# EAGLE schematic metal_mill_wiring (EAGLE 9.6.2)
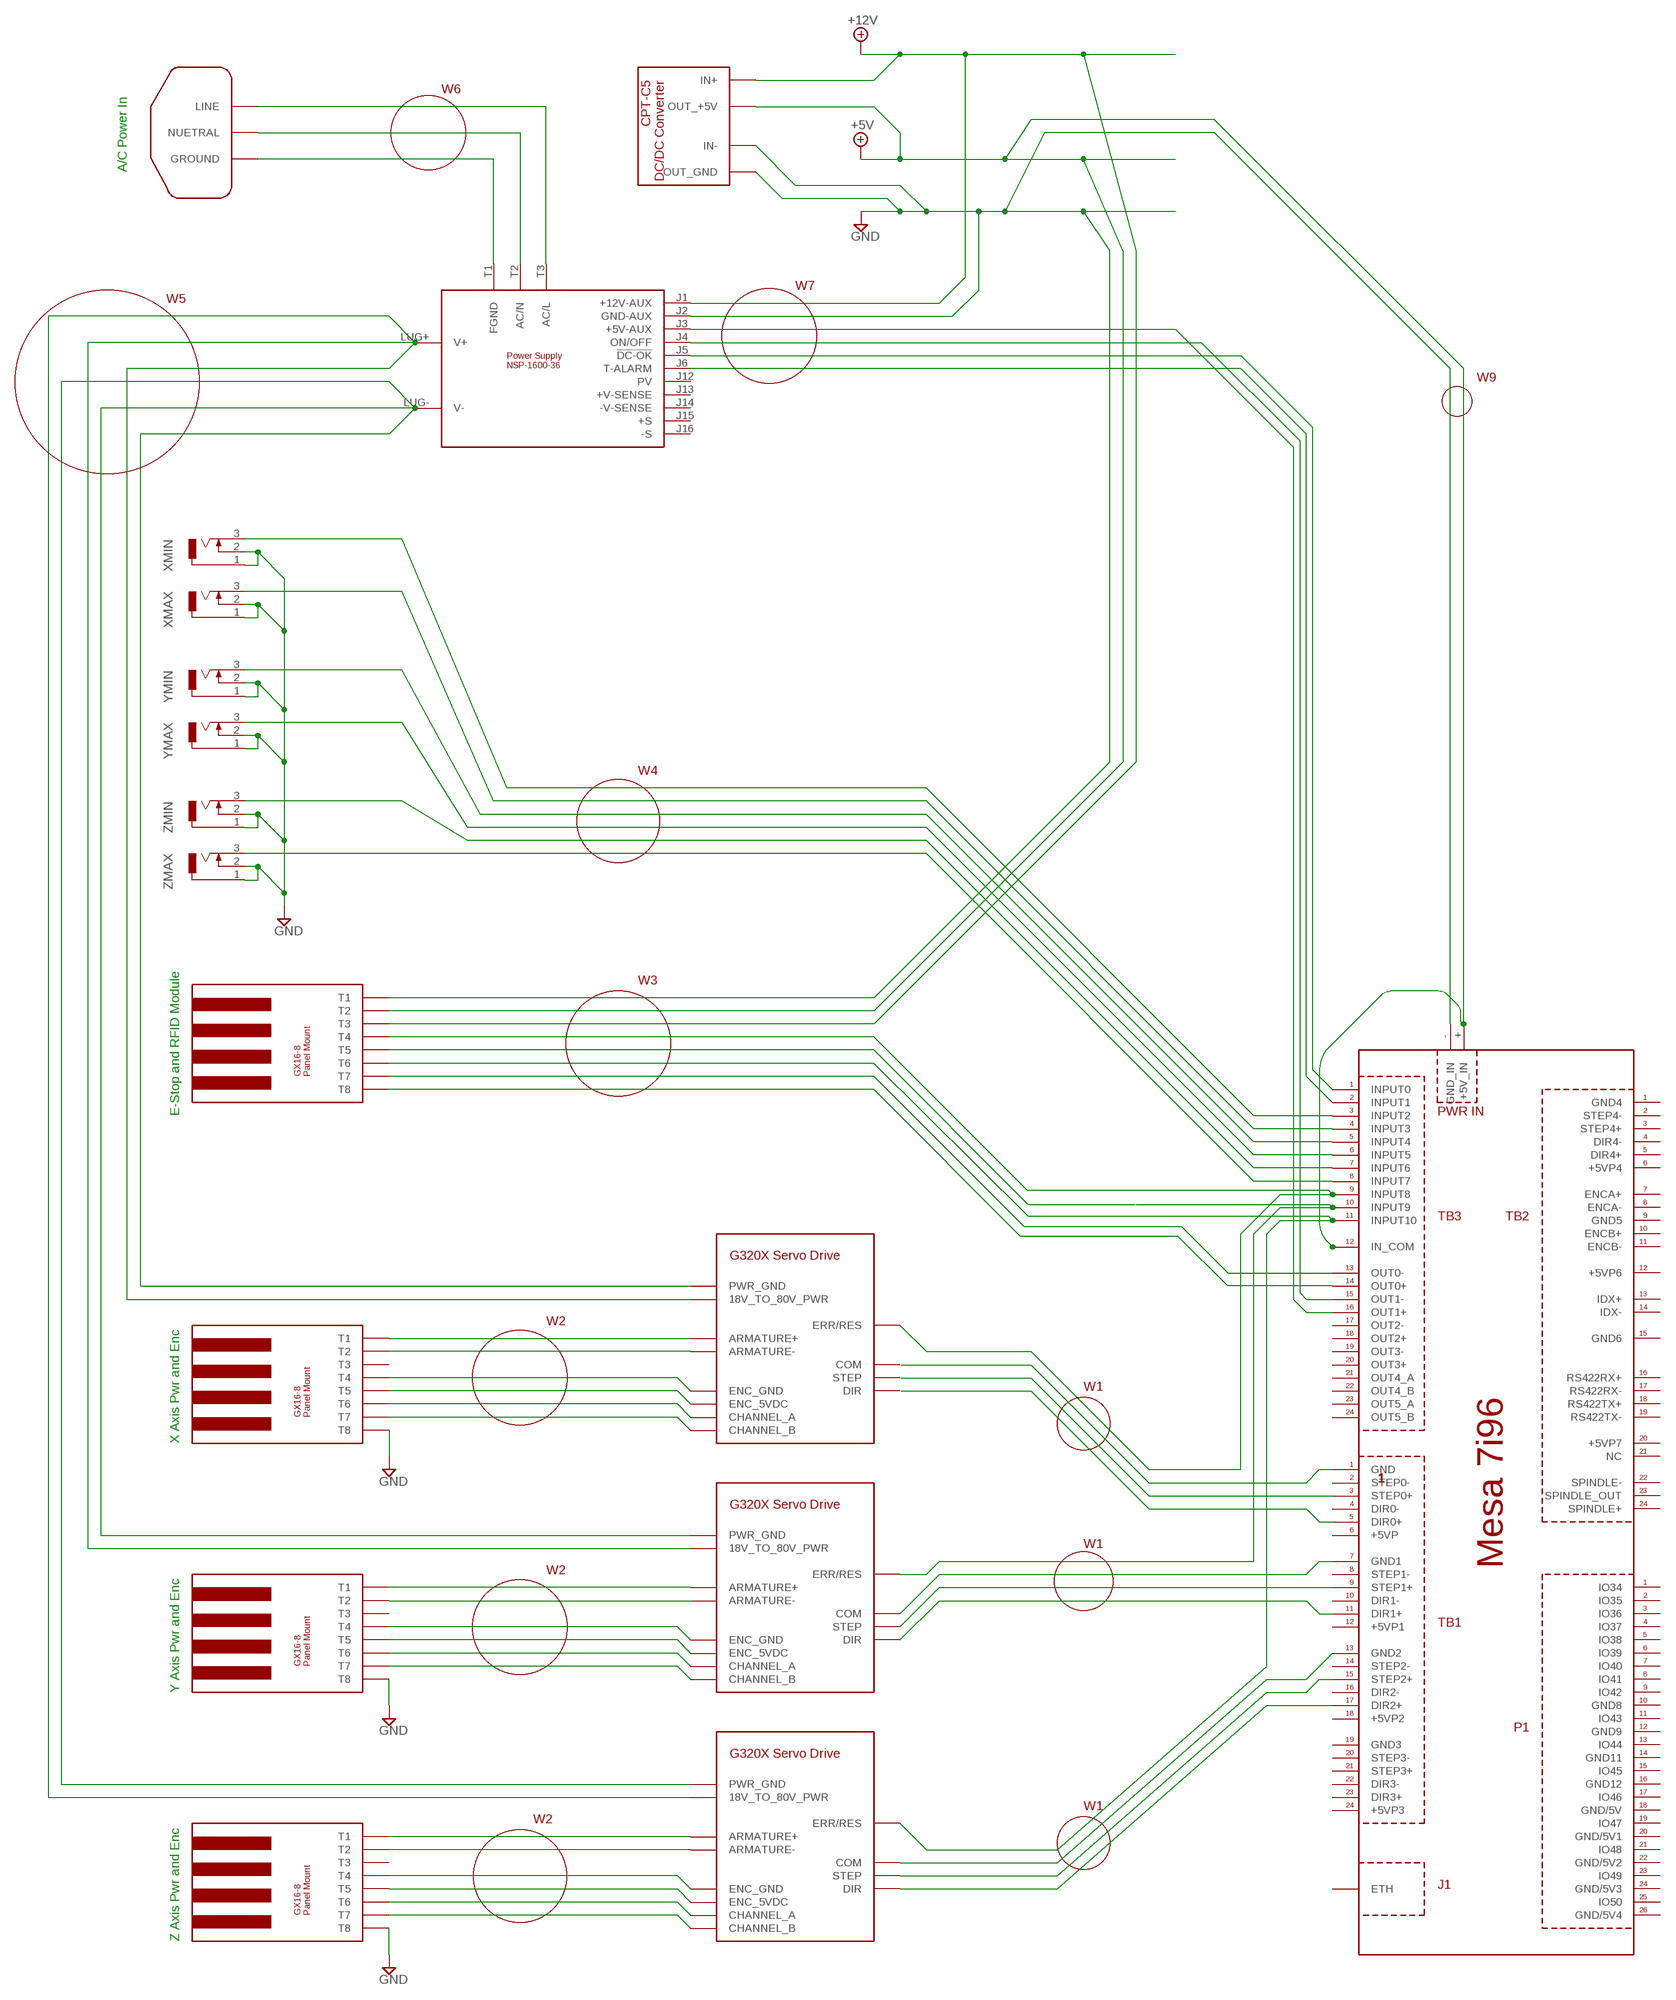
[diagram p0: schematic, sheet 1]

## Parts
U$1  MESA_7I96  [7I96]
U$2  G320X  [G320X]
U$3  G320X  [G320X]
U$4  G320X  [G320X]
U$5  NSP-1600-36  [NSP-1600-36]
U$6  CPT-C5  [CPT-C5]
U$7  GX16-8  [GX16-8]
U$8  GX16-8  [GX16-8]
U$9  AC_JACK  [AC_JACK]
X_AXIS  GX16-8  [GX16-8]
X_AXIS1  GX16-8  [GX16-8]
XMAX  DCJ0202  [DCJ0202]
XMIN  DCJ0202  [DCJ0202]
YMAX  DCJ0202  [DCJ0202]
YMIN  DCJ0202  [DCJ0202]
ZMAX  DCJ0202  [DCJ0202]
ZMIN  DCJ0202  [DCJ0202]

## Nets
+12V: U$5.J1(+12V-AUX) U$6.IN+ X_AXIS1.P$3(T3)
GND: U$1.-(GND_IN) U$5.J2(GND-AUX) U$6.IN- U$6.OUT-(OUT_GND) U$7.P$8(T8) U$8.P$8(T8) X_AXIS1.P$1(T1) X_AXIS.P$8(T8) XMAX.1 XMAX.2 XMIN.1 XMIN.2 YMAX.1 YMAX.2 YMIN.1 YMIN.2 ZMAX.1 ZMAX.2 ZMIN.1 ZMIN.2
N$1: U$1.TB1_1(GND)
N$2: U$1.TB1_3(STEP0+)
N$3: U$1.TB1_5(DIR0+)
N$4: U$1.TB1_11(DIR1+) U$3.P$10(DIR)
N$5: U$1.TB1_9(STEP1+) U$3.P$11(STEP)
N$6: U$1.TB1_7(GND1) U$3.P$12(COM)
N$7: U$1.TB1_13(GND2) U$2.P$12(COM)
N$8: U$1.TB1_15(STEP2+) U$2.P$11(STEP)
N$9: U$1.TB1_17(DIR2+) U$2.P$10(DIR)
N$10: U$2.P$2(18V_TO_80V_PWR) U$3.P$2(18V_TO_80V_PWR) U$4.P$2(18V_TO_80V_PWR) U$5.LUG+(V+)
N$11: U$2.P$1(PWR_GND) U$3.P$1(PWR_GND) U$4.P$1(PWR_GND) U$5.LUG-(V-)
N$12: U$5.T1(FGND) U$9.GROUND
N$13: U$2.P$4(ARMATURE+) U$7.P$1(T1)
N$14: U$1.TB3_1(INPUT0) U$5.J5(!DC-OK)
N$15: U$5.T2(AC/N) U$9.NUETRAL
N$17: U$2.P$3(ARMATURE-) U$7.P$2(T2)
N$18: U$3.P$9(CHANNEL_B) U$8.P$7(T7)
N$19: U$1.TB3_15(OUT1-) U$5.J4(ON/OFF)
N$20: U$5.T3(AC/L) U$9.LINE
N$21: U$1.TB3_9(INPUT8) U$4.P$5(ERR/RES) X_AXIS1.P$4(T4)
N$22: U$1.TB3_10(INPUT9) U$3.P$5(ERR/RES)
N$23: U$1.TB3_11(INPUT10) U$2.P$5(ERR/RES) X_AXIS1.P$6(T6)
N$24: U$4.P$9(CHANNEL_B) X_AXIS.P$7(T7)
N$25: U$3.P$8(CHANNEL_A) U$8.P$6(T6)
N$26: U$3.P$7(ENC_5VDC) U$8.P$5(T5)
N$27: U$3.P$6(ENC_GND) U$8.P$4(T4)
N$28: U$4.P$4(ARMATURE+) X_AXIS.P$1(T1)
N$29: U$4.P$3(ARMATURE-) X_AXIS.P$2(T2)
N$30: U$4.P$8(CHANNEL_A) X_AXIS.P$6(T6)
N$31: U$4.P$7(ENC_5VDC) X_AXIS.P$5(T5)
N$32: U$4.P$6(ENC_GND) X_AXIS.P$4(T4)
N$33: U$2.P$9(CHANNEL_B) U$7.P$7(T7)
N$34: U$2.P$8(CHANNEL_A) U$7.P$6(T6)
N$35: U$3.P$4(ARMATURE+) U$8.P$1(T1)
N$36: U$3.P$3(ARMATURE-) U$8.P$2(T2)
N$37: U$2.P$7(ENC_5VDC) U$7.P$5(T5)
N$38: U$2.P$6(ENC_GND) U$7.P$4(T4)
N$39: U$1.+(+5V_IN) U$6.OUT+(OUT_+5V) X_AXIS1.P$2(T2) ; supply symbol labelled +5V
N$41: U$1.TB3_16(OUT1+) U$5.J3(+5V-AUX)
N$42: U$1.TB3_13(OUT0-) X_AXIS1.P$7(T7)
N$43: U$1.TB3_2(INPUT1) U$5.J6(T-ALARM)
N$44: U$1.TB3_14(OUT0+) X_AXIS1.P$8(T8)
N$45: U$1.TB3_12(IN_COM)
N$46: U$1.TB3_3(INPUT2) XMIN.3
N$47: U$1.TB3_4(INPUT3) XMAX.3
N$48: U$1.TB3_5(INPUT4) YMIN.3
N$49: U$1.TB3_6(INPUT5) YMAX.3
N$50: U$1.TB3_7(INPUT6) ZMIN.3
N$51: U$1.TB3_8(INPUT7) ZMAX.3
N$52: X_AXIS1.P$5(T5)
Unconnected: U$1.J1(ETH) U$1.P1_1(IO34) U$1.P1_2(IO35) U$1.P1_3(IO36) U$1.P1_4(IO37) U$1.P1_5(IO38) U$1.P1_6(IO39) U$1.P1_7(IO40) U$1.P1_8(IO41) U$1.P1_9(IO42) U$1.P1_10(GND8) U$1.P1_11(IO43) U$1.P1_12(GND9) U$1.P1_13(IO44) U$1.P1_14(GND12) U$1.P1_15(IO45) U$1.P1_16(GND11) U$1.P1_17(IO46) U$1.P1_18(GND/5V1) U$1.P1_19(IO47) U$1.P1_20(GND/5V2) U$1.P1_21(IO48) U$1.P1_22(GND/5V) U$1.P1_23(IO49) U$1.P1_24(GND/5V3) U$1.P1_25(IO50) U$1.P1_26(GND/5V4) U$1.TB1_2(STEP0-) U$1.TB1_4(DIR0-) U$1.TB1_8(STEP1-) U$1.TB1_10(DIR1-) U$1.TB1_14(STEP2-) U$1.TB1_16(DIR2-) U$1.TB1_18(+5VP2) U$1.TB1_19(GND3) U$1.TB1_20(STEP3-) U$1.TB1_21(STEP3+) U$1.TB1_22(DIR3-) U$1.TB1_23(DIR3+) U$1.TB1_24(+5VP3) U$1.TB2_1(GND4) U$1.TB2_2(STEP4-) U$1.TB2_3(STEP4+) U$1.TB2_4(DIR4-) U$1.TB2_5(DIR4+) U$1.TB2_7(ENCA+) U$1.TB2_8(ENCA-) U$1.TB2_9(GND5) U$1.TB2_10(ENCB+) U$1.TB2_11(ENCB-) U$1.TB2_12(+5VP6) U$1.TB2_13(IDX+) U$1.TB2_14(IDX-) U$1.TB2_15(GND6) U$1.TB2_16(RS422RX+) U$1.TB2_17(RS422RX-) U$1.TB2_18(RS422TX+) U$1.TB2_19(RS422TX-) U$1.TB2_20(+5VP7) U$1.TB2_21(NC) U$1.TB2_22(SPINDLE-) U$1.TB2_23(SPINDLE_OUT) U$1.TB2_24(SPINDLE+) U$1.TB3_17(OUT2-) U$1.TB3_18(OUT2+) U$1.TB3_19(OUT3-) U$1.TB3_20(OUT3+) U$1.TB3_21(OUT4_A) U$1.TB3_22(OUT4_B) U$1.TB3_23(OUT5_A) U$1.TB3_24(OUT5_B) U$4.P$10(DIR) U$4.P$11(STEP) U$4.P$12(COM) U$5.J12(PV) U$5.J13(+V-SENSE) U$5.J14(-V-SENSE) U$5.J15(+S) U$5.J16(-S) U$7.P$3(T3) U$8.P$3(T3) X_AXIS.P$3(T3)

## Notes on the sheet
- W6
- A/C Power In
- W7
- W5
- W9
- W4
- W3
- E-Stop and RFID Module
- W2
- W1
- X Axis Pwr and Enc
- W1
- W2
- Y Axis Pwr and Enc
- W1
- W2
- Z Axis Pwr and Enc

## Power pins joined to a net without a drawn wire
+5VP: U$1.TB1_6(+5VP)
+5VP1: U$1.TB1_12(+5VP1)
+5VP4: U$1.TB2_6(+5VP4)

## Library data of the parts
U$1 = fcch_eagle_parts_metal_mill:MESA_7I96
U$2-U$4 = fcch_eagle_parts_metal_mill:G320X
U$5 = fcch_eagle_parts_metal_mill:NSP-1600-36
U$6 = fcch_eagle_parts_metal_mill:CPT-C5
U$7 U$8 X_AXIS X_AXIS1 = fcch_eagle_parts_metal_mill:GX16-8
U$9 = fcch_eagle_parts_metal_mill:AC_JACK
XMAX XMIN YMAX YMIN ZMAX ZMIN = con-jack:DCJ0202: DC POWER JACK Source: DCJ0202.pdf; OC_FARNELL: unknown; OC_NEWARK: unknown